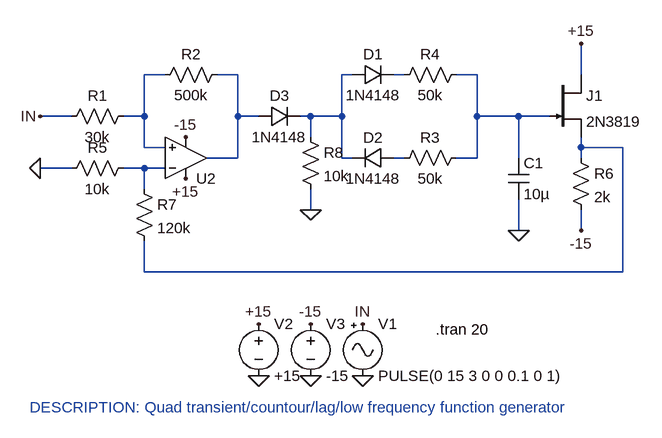
[diagram p0: schematic Hysteresis.asc]
Hysteresis.asc, the LTspice schematic file:
Version 4
SHEET 1 916 680
WIRE -96 48 -128 48
WIRE 16 48 -16 48
WIRE 192 48 176 48
WIRE 272 48 256 48
WIRE 384 48 352 48
WIRE 544 48 544 0
WIRE -240 112 -288 112
WIRE -128 112 -128 48
WIRE -128 112 -160 112
WIRE 16 112 16 48
WIRE 48 112 16 112
WIRE 128 112 112 112
WIRE 176 112 176 48
WIRE 176 112 128 112
WIRE 384 112 384 48
WIRE 448 112 384 112
WIRE 496 112 448 112
WIRE 128 144 128 112
WIRE -128 160 -128 112
WIRE -96 160 -128 160
WIRE 544 160 544 144
WIRE 608 160 544 160
WIRE 16 176 16 112
WIRE 16 176 -32 176
WIRE 176 176 176 112
WIRE 192 176 176 176
WIRE 272 176 256 176
WIRE 384 176 384 112
WIRE 384 176 352 176
WIRE 448 176 448 112
WIRE 544 176 544 160
WIRE -240 192 -288 192
WIRE -128 192 -160 192
WIRE -96 192 -128 192
WIRE -128 224 -128 192
WIRE 128 256 128 224
WIRE 448 288 448 240
WIRE 544 288 544 256
WIRE -128 352 -128 304
WIRE 608 352 608 160
WIRE 608 352 -128 352
FLAG 208 512 0
FLAG 448 288 0
FLAG 48 512 0
FLAG 128 512 0
FLAG 48 432 +15
FLAG 128 432 -15
FLAG 544 0 +15
FLAG -288 112 IN
FLAG 208 432 IN
FLAG -64 144 -15
FLAG 544 288 -15
FLAG -64 208 +15
FLAG -288 192 0
FLAG 128 256 0
SYMBOL res 0 32 R90
WINDOW 0 0 56 VBottom 0
WINDOW 3 32 56 VTop 0
SYMATTR InstName R2
SYMATTR Value 500k
SYMBOL res -144 96 R90
WINDOW 0 0 56 VBottom 0
WINDOW 3 32 56 VTop 0
SYMATTR InstName R1
SYMATTR Value 30k
SYMBOL Misc\\signal 208 416 R0
WINDOW 123 0 0 Left 0
WINDOW 39 0 0 Left 0
SYMATTR InstName V1
SYMATTR Value PULSE(0 15 3 0 0 0.1 0 1)
SYMBOL voltage 48 416 R0
WINDOW 123 0 0 Left 0
WINDOW 39 0 0 Left 0
SYMATTR InstName V2
SYMATTR Value +15
SYMBOL voltage 128 416 R0
WINDOW 123 0 0 Left 0
WINDOW 39 0 0 Left 0
SYMATTR InstName V3
SYMATTR Value -15
SYMBOL res -144 208 R0
SYMATTR InstName R7
SYMATTR Value 120k
SYMBOL res -144 176 R90
WINDOW 0 0 56 VBottom 0
WINDOW 3 32 56 VTop 0
SYMATTR InstName R5
SYMATTR Value 10k
SYMBOL cap 432 176 R0
SYMATTR InstName C1
SYMATTR Value 10µ
SYMBOL res 528 160 R0
SYMATTR InstName R6
SYMATTR Value 2k
SYMBOL Opamps\\UniversalOpamp2 -64 176 M180
SYMATTR InstName U2
SYMBOL diode 192 64 R270
WINDOW 0 32 32 VTop 0
WINDOW 3 0 32 VBottom 0
SYMATTR InstName D1
SYMATTR Value 1N4148
SYMBOL diode 256 160 R90
WINDOW 0 0 32 VBottom 0
WINDOW 3 32 32 VTop 0
SYMATTR InstName D2
SYMATTR Value 1N4148
SYMBOL res 368 160 R90
WINDOW 0 0 56 VBottom 0
WINDOW 3 32 56 VTop 0
SYMATTR InstName R3
SYMATTR Value 50k
SYMBOL res 368 32 R90
WINDOW 0 0 56 VBottom 0
WINDOW 3 32 56 VTop 0
SYMATTR InstName R4
SYMATTR Value 50k
SYMBOL njf 496 48 R0
SYMATTR InstName J1
SYMATTR Value 2N3819
SYMBOL res 112 128 R0
SYMATTR InstName R8
SYMATTR Value 10k
SYMBOL diode 48 128 R270
WINDOW 0 32 32 VTop 0
WINDOW 3 0 32 VBottom 0
SYMATTR InstName D3
SYMATTR Value 1N4148
TEXT 320 440 Left 0 !.tran 20
TEXT -304 560 Left 0 ;DESCRIPTION: Quad transient/countour/lag/low frequency function generator

The netlist it stands for:
* Hysteresis.asc
R2 N002 N001 500k
R1 N001 IN 30k
V1 IN 0 PULSE(0 15 3 0 0 0.1 0 1)
V2 +15 0 +15
V3 -15 0 -15
R7 N008 N006 120k
R5 N008 0 10k
C1 N005 0 10µ
R6 N006 -15 2k
XU2 N001 N008 +15 -15 N002 level.2 Avol=1Meg GBW=10Meg Slew=10Meg ilimit=25m rail=0 Vos=0 phimargin=45 en=0 enk=0 in=0 ink=0 Rin=500Meg  ; pins IN+ IN- V+ V- OUT
D1 N003 N004 1N4148
D2 N007 N003 1N4148
R3 N005 N007 50k
R4 N005 N004 50k
J1 +15 N005 N006 2N3819
R8 N003 0 10k
D3 N002 N003 1N4148
.model D D
.lib standard.dio
.model NJF NJF
.model PJF PJF
.lib standard.jft
.tran 20
* DESCRIPTION: Quad transient/countour/lag/low frequency function generator
.lib UniversalOpamps2.sub
.backanno
.end